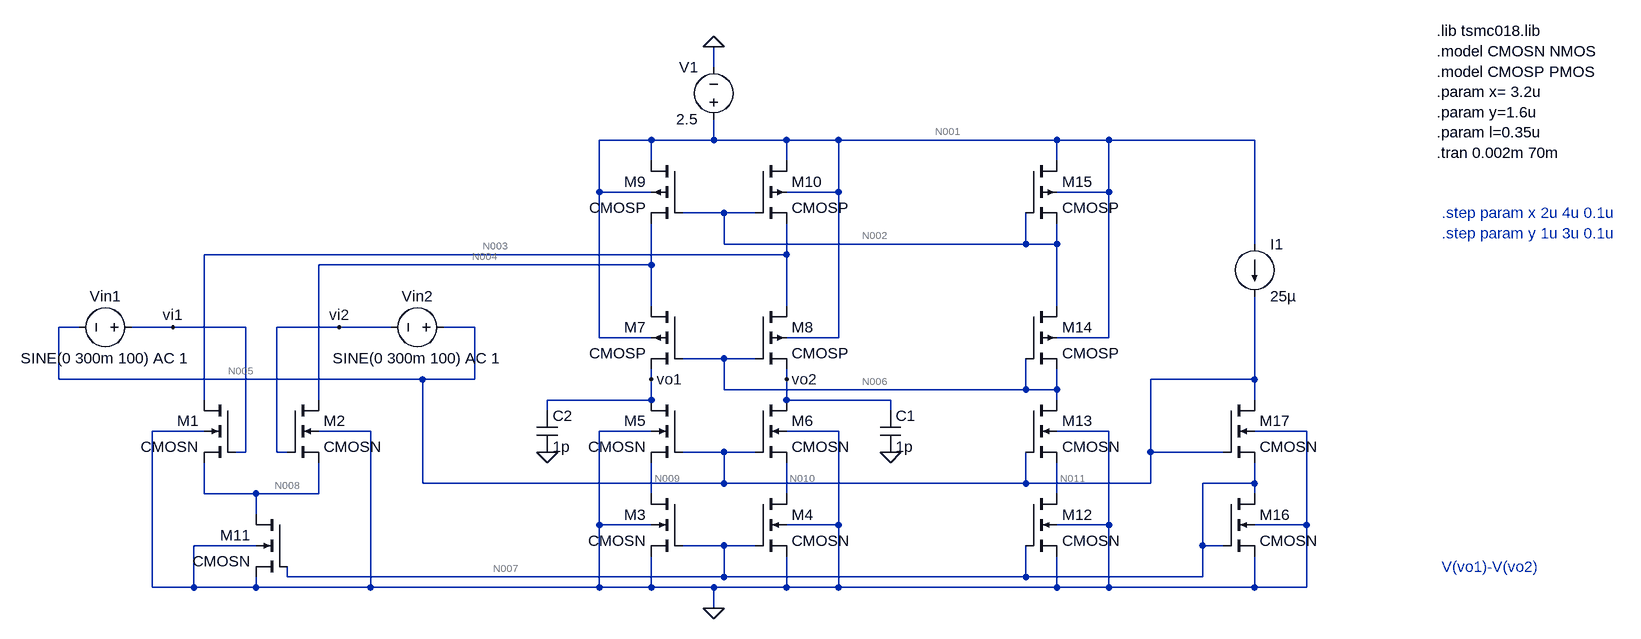
[diagram p0: schematic Draft1 - swing.asc]
Draft1 - swing.asc, the LTspice schematic file:
Version 4
SHEET 1 2420 2676
WIRE 624 -512 624 -544
WIRE 528 -400 448 -400
WIRE 624 -400 624 -432
WIRE 624 -400 528 -400
WIRE 736 -400 624 -400
WIRE 816 -400 736 -400
WIRE 1152 -400 816 -400
WIRE 1232 -400 1152 -400
WIRE 1456 -400 1232 -400
WIRE 528 -368 528 -400
WIRE 736 -368 736 -400
WIRE 1152 -368 1152 -400
WIRE 448 -320 448 -400
WIRE 528 -320 448 -320
WIRE 816 -320 816 -400
WIRE 816 -320 736 -320
WIRE 1232 -320 1232 -400
WIRE 1232 -320 1152 -320
WIRE 640 -288 576 -288
WIRE 688 -288 640 -288
WIRE 640 -240 640 -288
WIRE 1104 -240 1104 -288
WIRE 1104 -240 640 -240
WIRE 1152 -240 1152 -272
WIRE 1152 -240 1104 -240
WIRE 1456 -240 1456 -400
WIRE 736 -224 736 -272
WIRE 736 -224 -160 -224
WIRE 528 -208 528 -272
WIRE 528 -208 16 -208
WIRE 528 -144 528 -208
WIRE 736 -144 736 -224
WIRE 1152 -144 1152 -240
WIRE -352 -112 -384 -112
WIRE -208 -112 -272 -112
WIRE -96 -112 -208 -112
WIRE 48 -112 -48 -112
WIRE 128 -112 48 -112
WIRE 256 -112 208 -112
WIRE 448 -96 448 -320
WIRE 528 -96 448 -96
WIRE 816 -96 816 -320
WIRE 816 -96 736 -96
WIRE 1232 -96 1232 -320
WIRE 1232 -96 1152 -96
WIRE 640 -64 576 -64
WIRE 688 -64 640 -64
WIRE -384 -32 -384 -112
WIRE 176 -32 -384 -32
WIRE 256 -32 256 -112
WIRE 256 -32 176 -32
WIRE 528 -32 528 -48
WIRE 736 -32 736 -48
WIRE 1456 -32 1456 -160
WIRE 1456 -32 1296 -32
WIRE 640 -16 640 -64
WIRE 1104 -16 1104 -64
WIRE 1104 -16 640 -16
WIRE 1152 -16 1152 -48
WIRE 1152 -16 1104 -16
WIRE -160 0 -160 -224
WIRE 16 0 16 -208
WIRE 528 0 528 -32
WIRE 528 0 368 0
WIRE 736 0 736 -32
WIRE 896 0 736 0
WIRE 1152 0 1152 -16
WIRE 1456 0 1456 -32
WIRE 368 16 368 0
WIRE 896 16 896 0
WIRE -160 48 -240 48
WIRE 96 48 16 48
WIRE 528 48 448 48
WIRE 816 48 736 48
WIRE 1232 48 1152 48
WIRE 1536 48 1456 48
WIRE -96 80 -96 -112
WIRE -96 80 -112 80
WIRE -48 80 -48 -112
WIRE -32 80 -48 80
WIRE 640 80 576 80
WIRE 688 80 640 80
WIRE 1296 80 1296 -32
WIRE 1408 80 1296 80
WIRE 176 128 176 -32
WIRE 640 128 640 80
WIRE 640 128 176 128
WIRE 1104 128 1104 80
WIRE 1104 128 640 128
WIRE 1296 128 1296 80
WIRE 1296 128 1104 128
WIRE 1456 128 1456 96
WIRE 1456 128 1376 128
WIRE -160 144 -160 96
WIRE -80 144 -160 144
WIRE 16 144 16 96
WIRE 16 144 -80 144
WIRE 528 144 528 96
WIRE 736 144 736 96
WIRE 1152 144 1152 96
WIRE 1456 144 1456 128
WIRE -80 176 -80 144
WIRE 448 192 448 48
WIRE 528 192 448 192
WIRE 816 192 816 48
WIRE 816 192 736 192
WIRE 1232 192 1232 48
WIRE 1232 192 1152 192
WIRE 1536 192 1536 48
WIRE 1536 192 1456 192
WIRE -80 224 -176 224
WIRE 640 224 576 224
WIRE 688 224 640 224
WIRE 1376 224 1376 128
WIRE 1408 224 1376 224
WIRE -32 272 -32 256
WIRE 640 272 640 224
WIRE 640 272 -32 272
WIRE 1104 272 1104 224
WIRE 1104 272 640 272
WIRE 1376 272 1376 224
WIRE 1376 272 1104 272
WIRE -240 288 -240 48
WIRE -176 288 -176 224
WIRE -176 288 -240 288
WIRE -80 288 -80 272
WIRE -80 288 -176 288
WIRE 96 288 96 48
WIRE 96 288 -80 288
WIRE 448 288 448 192
WIRE 448 288 96 288
WIRE 528 288 528 240
WIRE 528 288 448 288
WIRE 624 288 528 288
WIRE 736 288 736 240
WIRE 736 288 624 288
WIRE 816 288 816 192
WIRE 816 288 736 288
WIRE 1152 288 1152 240
WIRE 1152 288 816 288
WIRE 1232 288 1232 192
WIRE 1232 288 1152 288
WIRE 1456 288 1456 240
WIRE 1456 288 1232 288
WIRE 1536 288 1536 192
WIRE 1536 288 1456 288
WIRE 624 320 624 288
FLAG 624 320 0
FLAG 624 -544 0
FLAG 528 -32 vo1
FLAG 736 -32 vo2
FLAG 48 -112 vi2
FLAG -208 -112 vi1
FLAG 368 80 0
FLAG 896 80 0
SYMBOL nmos4 -32 0 R0
SYMATTR InstName M2
SYMATTR Value CMOSN
SYMATTR Value2 l={l} w={x}
SYMBOL nmos4 -112 0 M0
SYMATTR InstName M1
SYMATTR Value CMOSN
SYMATTR Value2 l={l} w={x}
SYMBOL nmos4 576 144 M0
SYMATTR InstName M3
SYMATTR Value CMOSN
SYMATTR Value2 l={l} w={x}
SYMBOL nmos4 688 144 R0
SYMATTR InstName M4
SYMATTR Value CMOSN
SYMATTR Value2 l={l} w={x}
SYMBOL nmos4 576 0 M0
SYMATTR InstName M5
SYMATTR Value CMOSN
SYMATTR Value2 l={l} w={x}
SYMBOL nmos4 688 0 R0
SYMATTR InstName M6
SYMATTR Value CMOSN
SYMATTR Value2 l={l} w={x}
SYMBOL nmos4 -32 176 M0
SYMATTR InstName M11
SYMATTR Value CMOSN
SYMATTR Value2 l={l} w={2*x}
SYMBOL pmos4 576 -144 M0
SYMATTR InstName M7
SYMATTR Value CMOSP
SYMATTR Value2 l={l} w={y}
SYMBOL pmos4 688 -144 R0
SYMATTR InstName M8
SYMATTR Value CMOSP
SYMATTR Value2 l={l} w={y}
SYMBOL pmos4 688 -368 R0
SYMATTR InstName M10
SYMATTR Value CMOSP
SYMATTR Value2 l={l} w={2*y}
SYMBOL pmos4 576 -368 M0
SYMATTR InstName M9
SYMATTR Value CMOSP
SYMATTR Value2 l={l} w={2*y}
SYMBOL voltage 624 -416 R180
WINDOW 0 24 96 Left 2
WINDOW 3 24 16 Left 2
WINDOW 123 0 0 Left 0
WINDOW 39 0 0 Left 0
SYMATTR InstName V1
SYMATTR Value 2.5
SYMBOL voltage -256 -112 R90
WINDOW 0 -32 56 VBottom 2
WINDOW 3 32 56 VTop 2
SYMATTR InstName Vin1
SYMATTR Value SINE(0 300m 100) AC 1
SYMBOL voltage 224 -112 R90
WINDOW 0 -32 56 VBottom 2
WINDOW 3 32 56 VTop 2
SYMATTR InstName Vin2
SYMATTR Value SINE(0 300m 100) AC 1
SYMBOL nmos4 1104 144 R0
SYMATTR InstName M12
SYMATTR Value CMOSN
SYMATTR Value2 l={l} w={x}
SYMBOL nmos4 1104 0 R0
SYMATTR InstName M13
SYMATTR Value CMOSN
SYMATTR Value2 l={l} w={x}
SYMBOL pmos4 1104 -144 R0
SYMATTR InstName M14
SYMATTR Value CMOSP
SYMATTR Value2 l={l} w={y}
SYMBOL pmos4 1104 -368 R0
SYMATTR InstName M15
SYMATTR Value CMOSP
SYMATTR Value2 l={l} w={y}
SYMBOL nmos4 1408 144 R0
SYMATTR InstName M16
SYMATTR Value CMOSN
SYMATTR Value2 l={l} w={x}
SYMBOL nmos4 1408 0 R0
SYMATTR InstName M17
SYMATTR Value CMOSN
SYMATTR Value2 l={l} w={x}
SYMBOL current 1456 -240 R0
WINDOW 123 0 0 Left 0
WINDOW 39 0 0 Left 0
SYMATTR InstName I1
SYMATTR Value 25µ
SYMBOL cap 880 16 R0
SYMATTR InstName C1
SYMATTR Value 1p
SYMBOL cap 352 16 R0
SYMATTR InstName C2
SYMATTR Value 1p
TEXT 1736 -568 Left 2 !.lib tsmc018.lib\n.model CMOSN NMOS\n.model CMOSP PMOS\n.param x= 3.2u\n.param y=1.6u\n.param l=0.35u\n.tran 0.002m 70m
TEXT 1744 256 Left 2 ;V(vo1)-V(vo2)
TEXT 1744 -288 Left 2 ;.step param x 2u 4u 0.1u \n.step param y 1u 3u 0.1u

The netlist it stands for:
* Draft1 - swing.asc
M2 N004 vi2 N008 0 CMOSN l={l} w={x}
M1 N003 vi1 N008 0 CMOSN l={l} w={x}
M3 N009 N007 0 0 CMOSN l={l} w={x}
M4 N010 N007 0 0 CMOSN l={l} w={x}
M5 vo1 N005 N009 0 CMOSN l={l} w={x}
M6 vo2 N005 N010 0 CMOSN l={l} w={x}
M11 N008 N007 0 0 CMOSN l={l} w={2*x}
M7 N004 N006 vo1 N001 CMOSP l={l} w={y}
M8 N003 N006 vo2 N001 CMOSP l={l} w={y}
M10 N001 N002 N003 N001 CMOSP l={l} w={2*y}
M9 N001 N002 N004 N001 CMOSP l={l} w={2*y}
V1 N001 0 2.5
Vin1 vi1 N005 SINE(0 300m 100) AC 1
Vin2 N005 vi2 SINE(0 300m 100) AC 1
M12 N011 N007 0 0 CMOSN l={l} w={x}
M13 N006 N005 N011 0 CMOSN l={l} w={x}
M14 N002 N006 N006 N001 CMOSP l={l} w={y}
M15 N001 N002 N002 N001 CMOSP l={l} w={y}
M16 N007 N007 0 0 CMOSN l={l} w={x}
M17 N005 N005 N007 0 CMOSN l={l} w={x}
I1 N001 N005 25µ
C1 vo2 0 1p
C2 vo1 0 1p
.model NMOS NMOS
.model PMOS PMOS
.lib standard.mos
.lib tsmc018.lib
.model CMOSN NMOS
.model CMOSP PMOS
.param x= 3.2u
.param y=1.6u
.param l=0.35u
.tran 0.002m 70m
* V(vo1)-V(vo2)
* .step param x 2u 4u 0.1u
* .step param y 1u 3u 0.1u
.backanno
.end

* Results of the author's LTspice run, read from the files saved beside the schematic
* Operating Point, zero values left out:
*   V(n004) = 1.76 V
*   V(vi2) = 1.046 V
*   V(n008) = 522.9 mV
*   V(n003) = 1.76 V
*   V(vi1) = 1.046 V
*   V(n009) = 522.1 mV
*   V(n007) = 522.9 mV
*   V(n010) = 522.1 mV
*   V(vo1) = 1.016 V
*   V(n005) = 1.046 V
*   V(vo2) = 1.016 V
*   V(n006) = 1.021 V
*   V(n001) = 2.5 V
*   V(n002) = 1.76 V
*   V(n011) = 522.3 mV
*   Id(M15) = 25 µA
*   Is(M15) = -25 µA
*   Id(M14) = 25 µA
*   Ib(M14) = 2.239 pA
*   Is(M14) = -25 µA
*   Id(M9) = 50 µA
*   Is(M9) = -50 µA
*   Id(M10) = 50 µA
*   Is(M10) = -50 µA
*   Id(M8) = 25 µA
*   Ib(M8) = 2.244 pA
*   Is(M8) = -25 µA
*   Id(M7) = 25 µA
*   Ib(M7) = 2.244 pA
*   Is(M7) = -25 µA
*   Id(M17) = 25 µA
*   Ib(M17) = -1.589 pA
*   Is(M17) = -25 µA
*   Id(M16) = 25 µA
*   Is(M16) = -25 µA
*   Id(M13) = 25 µA
*   Ib(M13) = -1.563 pA
*   Is(M13) = -25 µA
*   Id(M12) = 25 µA
*   Is(M12) = -25 µA
*   Id(M11) = 50 µA
*   Is(M11) = -50 µA
*   Id(M6) = 25 µA
*   Ib(M6) = -1.558 pA
*   Is(M6) = -25 µA
*   Id(M5) = 25 µA
*   Ib(M5) = -1.558 pA
*   Is(M5) = -25 µA
*   Id(M4) = 25 µA
*   Is(M4) = -25 µA
*   Id(M3) = 25 µA
*   Is(M3) = -25 µA
*   Id(M1) = 25 µA
*   Ib(M1) = -2.303 pA
*   Is(M1) = -25 µA
*   Id(M2) = 25 µA
*   Ib(M2) = -2.303 pA
*   Is(M2) = -25 µA
*   I(I1) = 25 µA
*   I(V1) = -150 µA
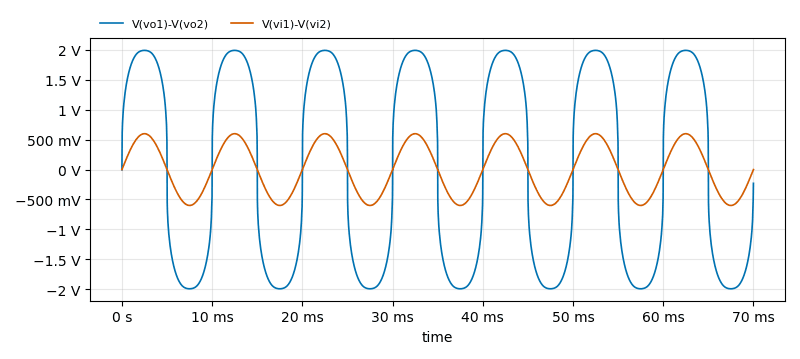
[diagram p1: Transient Analysis of Draft1 - swing.asc, plotted from the saved traces]
* Transient Analysis, 1 run:
*   V(vo1)-V(vo2): min -1.993 V, max 1.993 V, average 95.97 µV, rms 1.732 V, last -229.6 mV
*   V(vi1)-V(vi2): min -600 mV, max 600 mV, average 0 V, rms 424.3 mV, last 0 V